# EAGLE design airflow_sensor_hot_wire (EAGLE 9.5.2)
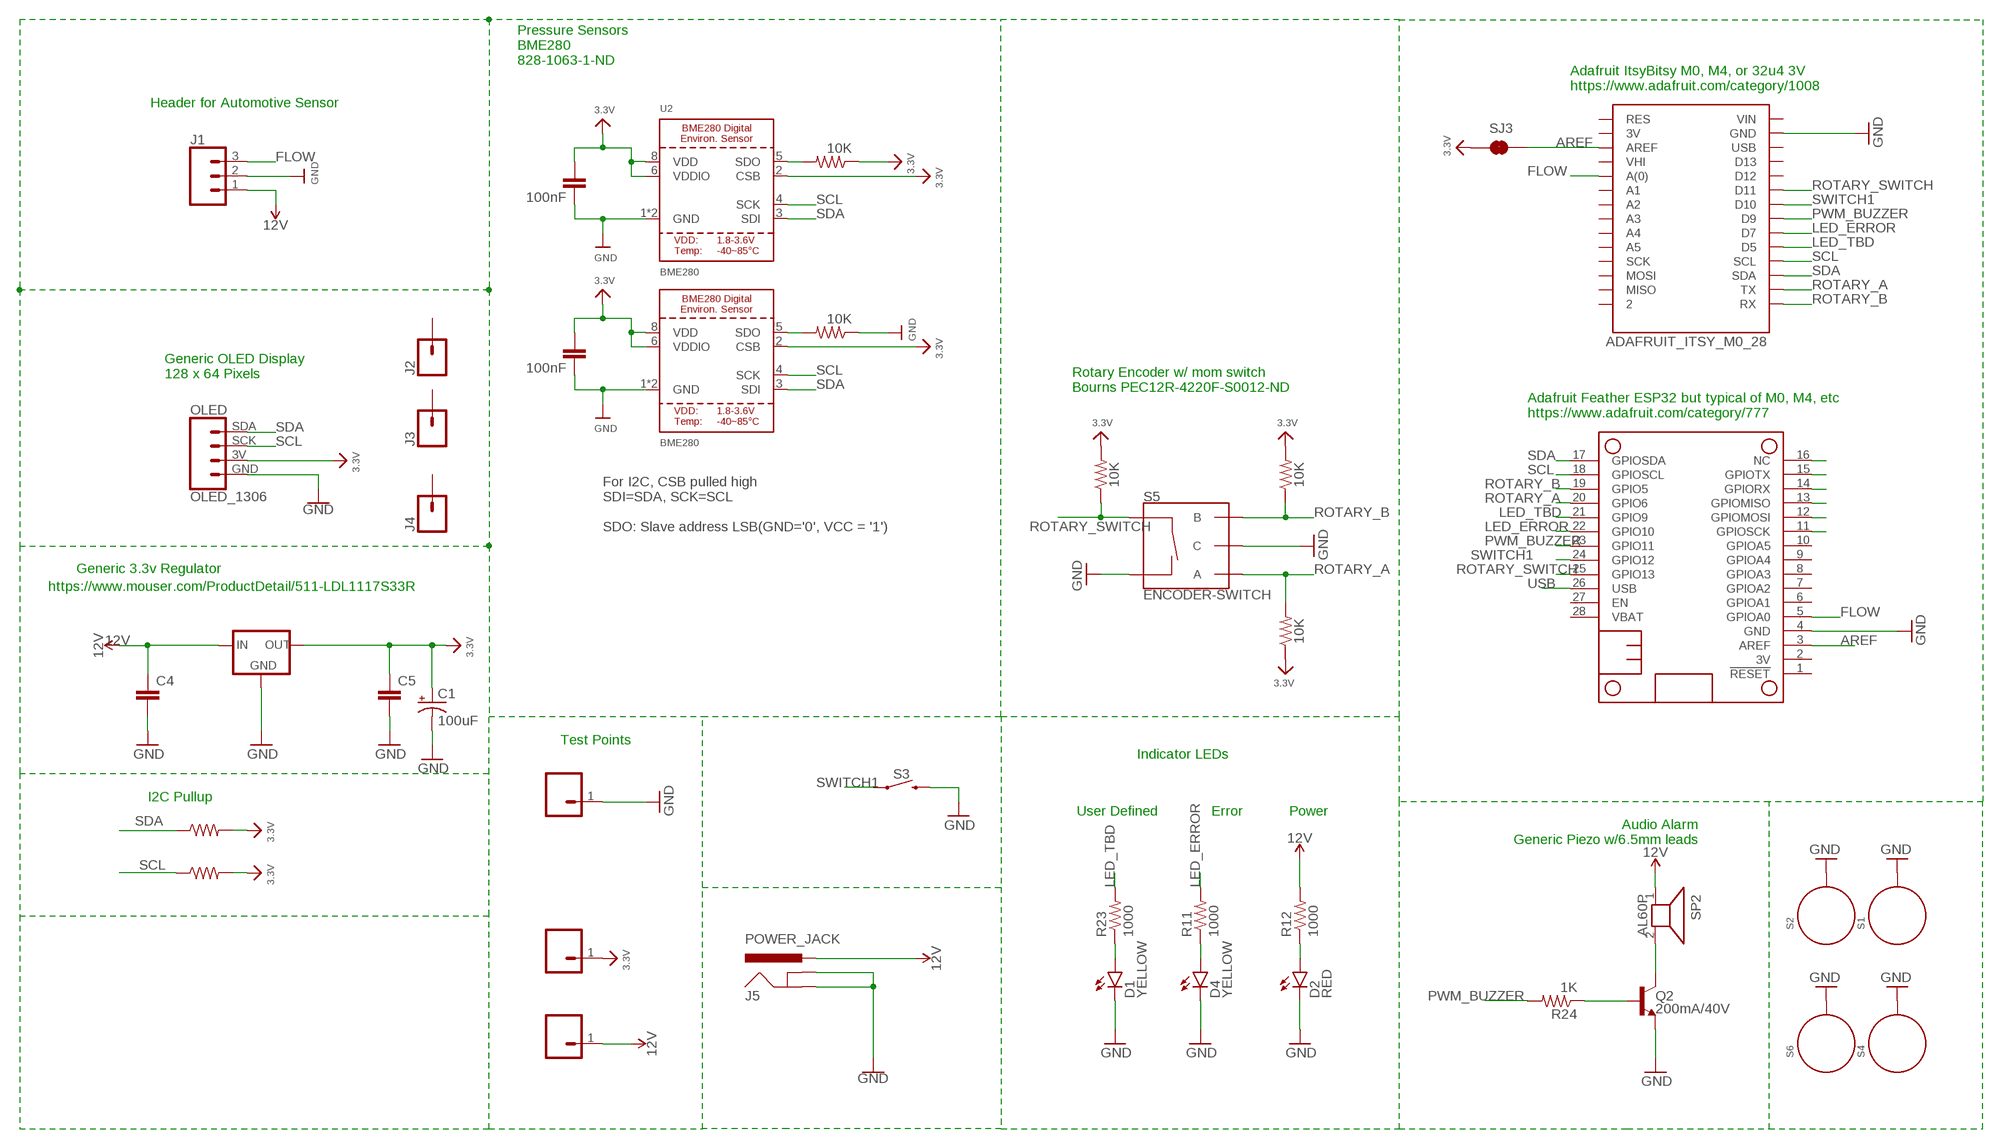
[diagram p0: schematic, sheet 1]

## Parts
3V_REGULATOR  LDL1117_5V_REG  [SOT223]
C1  100uF  100UF-POLAR-RADIAL-2.5MM-25V-20%  [CPOL-RADIAL-2.5MM-6.5MM]
C4  CAP-0805  [0805]
C5  CAP-0805  [0805]
C10  100nF  CAP-0805  [0805]
C12  100nF  CAP-0805  [0805]
D1  YELLOW  LED-YELLOWLARGE  [LED-1206]
D2  RED  LED-RED1206  [LED-1206]
D4  YELLOW  LED-YELLOWLARGE  [LED-1206]
J1  CONN_03-SCREW-5MM  [SCREWTERMINAL-5MM-3]
J2  CONN_01  [1X01]
J3  CONN_01  [1X01]
J4  CONN_01  [1X01]
J5  POWER_JACK  [POWER_JACK_PTH]
MS2  FEATHERWING_NODIM  [FEATHERWING_DIM]
Q2  200mA/40V  TRANS_NPN-2N3904  [TO-92]
R1  10K  RESISTOR0805-RES  [0805]
R2  10K  RESISTOR0805-RES  [0805]
R11  1000  RESISTOR0805-RES  [0805]
R12  1000  RESISTOR0805-RES  [0805]
R21  0.3  0.3OHM-0805-1/8W-1%  [0805]
R22  0.3  0.3OHM-0805-1/8W-1%  [0805]
R23  1000  RESISTOR0805-RES  [0805]
R24  1K  RESISTOR0805-RES  [0805]
R26  10K  0.3OHM-0805-1/8W-1%  [0805]
R27  10K  0.3OHM-0805-1/8W-1%  [0805]
R28  10K  0.3OHM-0805-1/8W-1%  [0805]
S1  STANDOFF_ELECTRICAL5-32  [STANDOFF_ELECTRICAL_5_32]
S2  STANDOFF_ELECTRICAL5-32  [STANDOFF_ELECTRICAL_5_32]
S3  MOMENTARY-SWITCH-SPST-PTH-6.0MM-KIT  [TACTILE_SWITCH_PTH_6.0MM_KIT]
S4  STANDOFF_ELECTRICAL5-32  [STANDOFF_ELECTRICAL_5_32]
S5  ENCODER-SWITCH  [ROTARY_ENC_PLAIN]
S6  STANDOFF_ELECTRICAL5-32  [STANDOFF_ELECTRICAL_5_32]
SJ3  PWR-LED  JUMPER-PAD-2-NC_BY_TRACENO_SILK  [PAD-JUMPER-2-NC_BY_TRACE_NO_SILK]
SP2  AL60P  [AL60P]
U2  BME280  [BME280]
U4  BME280  [BME280]
U$1  OLED_1306  [OLED_1306]
U$20  CONN_0138MILL  [1X01-40MILL]
U$31  CONN_0138MILL  [1X01-40MILL]
U$40  CONN_0138MILL  [1X01-40MILL]
U$45  ADAFRUIT_ITSY_M0_28  [ADAFRUIT_ITS_MO_28]

## Nets
3.3V: 3V_REGULATOR.2(OUT) 3V_REGULATOR.4(OUT) C1.1(+) C5.1 C10.1 C12.1 R2.1 R21.2 R22.2 R26.2 R27.1 R28.2 SJ3.2 U2.2(CSB) U2.6(VDDIO) U2.8(VDD) U4.2(CSB) U4.6(VDDIO) U4.8(VDD) U$1.3V(VCC) U$20.1
12V: 3V_REGULATOR.3(IN) C4.1 J1.1 J5.PWR R12.2 SP2.1 U$40.1
AREF: MS2.3(AREF) SJ3.1 U$45.AREF
FLOW: J1.3 MS2.5(GPIOA0) U$45.A0(A(0))
GND: 3V_REGULATOR.1(GND) C1.2(-) C4.2 C5.2 C10.2 C12.2 D1.C D2.C D4.C J1.2 J5.GND J5.GNDBREAK MS2.4(GND) Q2.1(E) R1.1 S1.P1 S2.P1 S3.3 S4.P1 S5.C S5.SW- S6.P1 U2.1(GND) U2.7(GND) U4.1(GND) U4.7(GND) U$1.GND U$31.1 U$45.GND
LED_ERROR: MS2.22(GPIO10) R11.2 U$45.D7
LED_TBD: MS2.21(GPIO9) R23.2 U$45.D5
N$2: D2.A R12.1
N$3: D1.A R23.1
N$6: R1.2 U4.5(SDO)
N$7: MS2.16(NC)
N$8: R2.2 U2.5(SDO)
N$9: Q2.3(C) SP2.2
N$10: Q2.2(B) R24.1
N$11: D4.A R11.1
N$13: MS2.15(GPIOTX)
N$14: MS2.14(GPIORX)
N$15: MS2.13(GPIOMISO)
N$16: MS2.12(GPIOMOSI)
N$17: MS2.11(GPIOSCK)
PWM_BUZZER: MS2.23(GPIO11) R24.2 U$45.D9
ROTARY_A: MS2.20(GPIO6) R27.2 S5.A U$45.TX
ROTARY_B: MS2.19(GPIO5) R26.1 S5.B U$45.RX
ROTARY_SWITCH: MS2.25(GPIO13) R28.1 S5.SW+ U$45.D11
SCL: MS2.18(GPIOSCL) R22.1 U2.4(SCK) U4.4(SCK) U$1.SCK U$45.SCL
SDA: MS2.17(GPIOSDA) R21.1 U2.3(SDI) U4.3(SDI) U$1.SDA U$45.SDA
SWITCH1: MS2.24(GPIO12) S3.1 U$45.D10
USB: MS2.26(USB)
Unconnected: J2.1 J3.1 J4.1 MS2.1(!RESET) MS2.2(3V) MS2.6(GPIOA1) MS2.7(GPIOA2) MS2.8(GPIOA3) MS2.9(GPIOA4) MS2.10(GPIOA5) MS2.27(EN) MS2.28(VBAT) U$45.2 U$45.3V U$45.A1 U$45.A2 U$45.A3 U$45.A4 U$45.A5 U$45.D12 U$45.D13 U$45.MISO U$45.MOSI U$45.RES U$45.SCK U$45.USB U$45.VHI U$45.VIN

## Notes on the sheet
- Pressure Sensors
  BME280
  828-1063-1-ND
- Adafruit ItsyBitsy M0, M4, or 32u4 3V
  https://www.adafruit.com/category/1008
- Header for Automotive Sensor
- Generic OLED Display
  128 x 64 Pixels
- Rotary Encoder w/ mom switch
  Bourns PEC12R-4220F-S0012-ND
- Adafruit Feather ESP32 but typical of M0, M4, etc
  https://www.adafruit.com/category/777
- For I2C, CSB pulled high
  SDI=SDA, SCK=SCL
  
  SDO: Slave address LSB(GND='0', VCC = '1')
- https://www.mouser.com/ProductDetail/511-LDL1117S33R | Generic 3.3v Regulator
- Test Points
- Indicator LEDs
- I2C Pullup
- User Defined | Error | Power
- Audio Alarm
  Generic Piezo w/6.5mm leads

## Library data of the parts
3V_REGULATOR = th_libraries_2:LDL1117_5V_REG: STMicroelectronics LDL1117S50R https://www.mouser.com/datasheet/2/389/ldl1117-1156241.pdf Mouser#: 511-LDL1117S50R bought 100 for $18 on ~2/3/18 5V, 1.2amp
C1 = SparkFun-Capacitors:100UF-POLAR: 100µF polarized capacitors A capacitor is a passive two-terminal electrical component used to store electrical energy temporarily in an electric field.; PROD_ID: CAP-08439
C4 C5 C10 C12 = SparkFun-Capacitors:CAP
D1 D4 = SparkFun-LED:LED-YELLOW: Yellow SMD LEDs LilyPad 1206- DIO-09909 0603- DIO-09003 "SMART" means more efficient and expensive; PROD_ID: DIO-00820
D2 = SparkFun-LED:LED-RED: Assorted Red LEDs LilyPad 1206- DIO-09912 1206- DIO-00809 0603- DIO-00819 "SMART" means more efficient and expensive; PROD_ID: DIO-00809
J1 = SparkFun-Connectors:CONN_03: Multi connection point. Often used as Generic Header-pin footprint for 0.1 inch spaced/style header connections On any of the 0.1 inch spaced packages, you can populate with these: Break Away Headers - Straight <https://www.sparkfun.com/products/116> (PRT-00116) Break Away Male Headers - Right Angle <https://www.sparkfun.com/products/553> (PRT-00553) Female Headers <https://www.sparkfun.com/products/115> (PRT-00115) Break Away Headers - Machine Pin <https://www.sparkfun.com/products/117> (PRT-00117) Break Away Female Headers - Swiss Machine Pin <https://www.sparkfun.com/products/743> (PRT-00743) Stackable Header - 3 Pin (Female, 0.1") <https://www.sparkfun.com/products/13875> (PRT-13875) For SCREWTERMINALS and SPRING TERMINALS visit here: Screw Terimnals on SparkFun.com <https://www.sparkfun.com/search/results?term=Screw+Terminals> (5mm/3.5mm/2.54mm spacing) This device is also useful as a general connection point to wire up your design to another part of your project. Our various solder wires solder well into these plated through hole pads. Hook-Up Wire - Assortment (Stranded, 22 AWG) <https://www.sparkfun.com/products/11375> (PRT-11375) Hook-Up Wire - Assortment (Solid Core, 22 AWG) <https://www.sparkfun.com/products/11367> (PRT-11367) View the entire wire category on our website here <https://www.sparkfun.com/categories/141> Special notes: Molex polarized connector foot print use with SKU : PRT-08232 with associated crimp pins and housings.; PROD_ID: CONN-10134; SF_SKU: PRT-08433
J2-J4 = SparkFun-Connectors:CONN_01: Single connection point. Often used as Generic Header-pin footprint for 0.1 inch spaced/style header connections On any of the 0.1 inch spaced packages, you can populate with these: Break Away Headers - Straight <https://www.sparkfun.com/products/116> (PRT-00116) Break Away Male Headers - Right Angle <https://www.sparkfun.com/products/553> (PRT-00553) Female Headers <https://www.sparkfun.com/products/115> (PRT-00115) Break Away Headers - Machine Pin <https://www.sparkfun.com/products/117> (PRT-00117) Break Away Female Headers - Swiss Machine Pin <https://www.sparkfun.com/products/743> (PRT-00743) This device is also useful as a general connection point to wire up your design to another part of your project. Our various solder wires solder well into these plated through hole pads. Hook-Up Wire - Assortment (Stranded, 22 AWG) <https://www.sparkfun.com/products/11375> (PRT-11375) Hook-Up Wire - Assortment (Solid Core, 22 AWG) <https://www.sparkfun.com/products/11367> (PRT-11367) View the entire wire category on our website here <https://www.sparkfun.com/categories/141> Special notes: SMTSO-256-ET is a "flush mount" nut for a 4-40 screw. We mostly use this on specialty testbeds; it is a nice way to connect hardware to your PCB at an adjustable hieght. Also note, the SNAP packages are for using a snappable style connector. We sell a baggie of snaps and they are also used on two LilyPad designs: Snap Assortment - 30 pack (male and female) <https://www.sparkfun.com/products/11347> (DEV-11347) LilyPad Arduino SimpleSnap <https://www.sparkfun.com/products/10941> (DEV-10941) LilyPad SimpleSnap Protoboard <https://www.sparkfun.com/products/10940> (DEV-10940)
J5 = SparkFun-Connectors:POWER_JACK: Power Jack Connector This is the standard 5.5mm barrel jack for power. The PTH is the most common, proven, reliable, footprint. The Slot footprint only works if the mill layer is transmitted to the PCB fab house so be warned. Here are the connectors we sell at SparkFun: DC Barrel Power Jack/Connector <https://www.sparkfun.com/products/119> (PRT-00119) DC Barrel Power Jack/Connector (SMD) <https://www.sparkfun.com/products/12748> (PRT-12748) DC Barrel Jack Adapter - Breadboard Compatible <https://www.sparkfun.com/products/10811> (PRT-10811) It is used on this SparkFun product (and many, many others): SparkFun RedBoard - Programmed with Arduino <https://www.sparkfun.com/products/12757> (DEV-12757) Also, if you need a mating power supply or connector, please check these out: Wall Adapter Power Supply - 9VDC 650mA <https://www.sparkfun.com/products/298> (TOL-00298) DC Barrel Jack Adapter - Male <https://www.sparkfun.com/products/10287> (PRT-10287); PROD_ID: CONN-08197
MS2 = th_libraries:FEATHERWING
Q2 = SparkFun-DiscreteSemi:TRANS_NPN: NPN transistor Current controlled devices typically used to amplify current or used as a switch. BC547 - COM-08928 <http://www.sparkfun.com/products/8928> (TO-92 45V 100mA) (1.Collector 2.Base 3.Emitter) 2N3904 - COM-00521 <http://www.sparkfun.com/products/521> (TO-92 40V 200mA) (1.Emitter 2.Base 3.Collector) P2N2222A - COM-12852 <http://www.sparkfun.com/products/12852> (TO-92 40V 600mA) (1.Collector 2.Base 3.Emitter); PROD_ID: TRANS-08447
R1 R2 R11 R12 R23 R24 = SparkFun-Passives:RESISTOR: Resistor Basic schematic elements and footprints for 0603, 1206, and PTH resistors.
R21 R22 = SparkFun-Resistors:0.3OHM: 0.3Ω resistor A resistor is a passive two-terminal electrical component that implements electrical resistance as a circuit element. Resistors act to reduce current flow, and, at the same time, act to lower voltage levels within circuits. - Wikipedia; PROD_ID: RES-11622
R26-R28 = SparkFun-Resistors:0.3OHM: 0.3Ω resistor A resistor is a passive two-terminal electrical component that implements electrical resistance as a circuit element. Resistors act to reduce current flow, and, at the same time, act to lower voltage levels within circuits. - Wikipedia; PROD_ID: RES-11622; VALUE: 0.3
S1 S2 S4 S6 = th_libraries:STANDOFF_ELECTRICAL: A standoff intended to be an electrically connected point. Pad size and stop size allow for a #8 Phillips pan screw head to make a solid connection to the board. Added 144mill drill hole that fits my normal wood screw
S3 = SparkFun-Switches:MOMENTARY-SWITCH-SPST: Momentary Switch (Pushbutton) - SPST Normally-open (NO) SPST momentary switches (buttons, pushbuttons). Variants PTH-12MM - 12mm square, through-hole Momentary Pushbutton Switch - 12mm Square <https://www.sparkfun.com/products/9190> (COM-09190) PTH-6.0MM, PTH-6.0MM-KIT - 6.0mm square, through-hole Mini Pushbutton Switch <https://www.sparkfun.com/products/97> (COM-00097) KIT package intended for soldering kit's - only one side of pads' copper is exposed. PTH-RIGHT-ANGLE-KIT - Right-angle, through-hole Right Angle Tactile Button <https://www.sparkfun.com/products/10791> - Used on SparkFun BigTime Watch Kit <https://www.sparkfun.com/products/11734> SMD-12MM - 12mm square, surface-mount Tactile Button - SMD (12mm) <https://www.sparkfun.com/products/12993> (COM-12993) Used on SparkFun PicoBoard <https://www.sparkfun.com/products/11888> SMD-4.5MM - 4.5mm Square Trackball Switch Used on SparkFun Blackberry Trackballer Breakout <https://www.sparkfun.com/products/13169> SMD-4.6MMX2.8MM - 4.60mm x 2.80mm, surface mount Used on SparkFun SAMD21 Mini Breakout <https://www.sparkfun.com/products/13664> SMD-5.2MM, SMD-5.2-REDUNDANT - 5.2mm square, surface-mount Mini Pushbutton Switch - SMD <https://www.sparkfun.com/products/8720> (COM-08720) Used on Arduino Pro Mini <https://www.sparkfun.com/products/11114> REDUNDANT package connects both switch circuits together SMD-6.0X3.5MM - 6.0 x 3.5mm, surface mount Momentary Reset Switch SMD <https://www.sparkfun.com/products/8229> (COM-08229) SMD-6.2MM-TALL - 6.2mm square, surface mount Tactile Button - SMD (6mm) <https://www.sparkfun.com/products/12992> Used on SparkFun Digital Sandbox <https://www.sparkfun.com/products/12651> SMD-RIGHT-ANGLE - Right-angle, surface mount Used on SparkFun Block for Intel® Edison - Arduino <https://www.sparkfun.com/products/13036>; PROD_ID: SWCH-08441; SF_SKU: COM-00097
S5 = SparkFun-Switches:ENCODER-SWITCH: Rotary Encoder w/ Select Switch Encoders rotate similarly to potentiometers, but they’re different from potentiometers in that an encoder has full rotation without limits. They output gray code so that you can tell how much and in which direction the encoder has been turned. This encoder includes a push-down select switch built into the shaft. SparkFun Products Rotary Encoder <https://www.sparkfun.com/products/9117> (COM-09117); SF_SKU: COM-09117
SJ3 = SparkFun-Passives:JUMPER-PAD-2-NC_BY_TRACE
SP2 = buzzer:AL60P: SPEAKER Source: Buerklin; OC_FARNELL: unknown; OC_NEWARK: unknown
U2 U4 = microbuilder:BME280: BME280 - Environmental Sensor (I2C + SPI)
U$1 = air_flow:OLED_1306
U$20 U$31 U$40 = th_libraries3:CONN_01
U$45 = easy_bee_counter:ADAFRUIT_ITSY_M0_28

## Net classes
1 highpower: width 0.305 mm, drill 0.483 mm
2 lowpower: width 0.305 mm, drill 0.483 mm

## Board
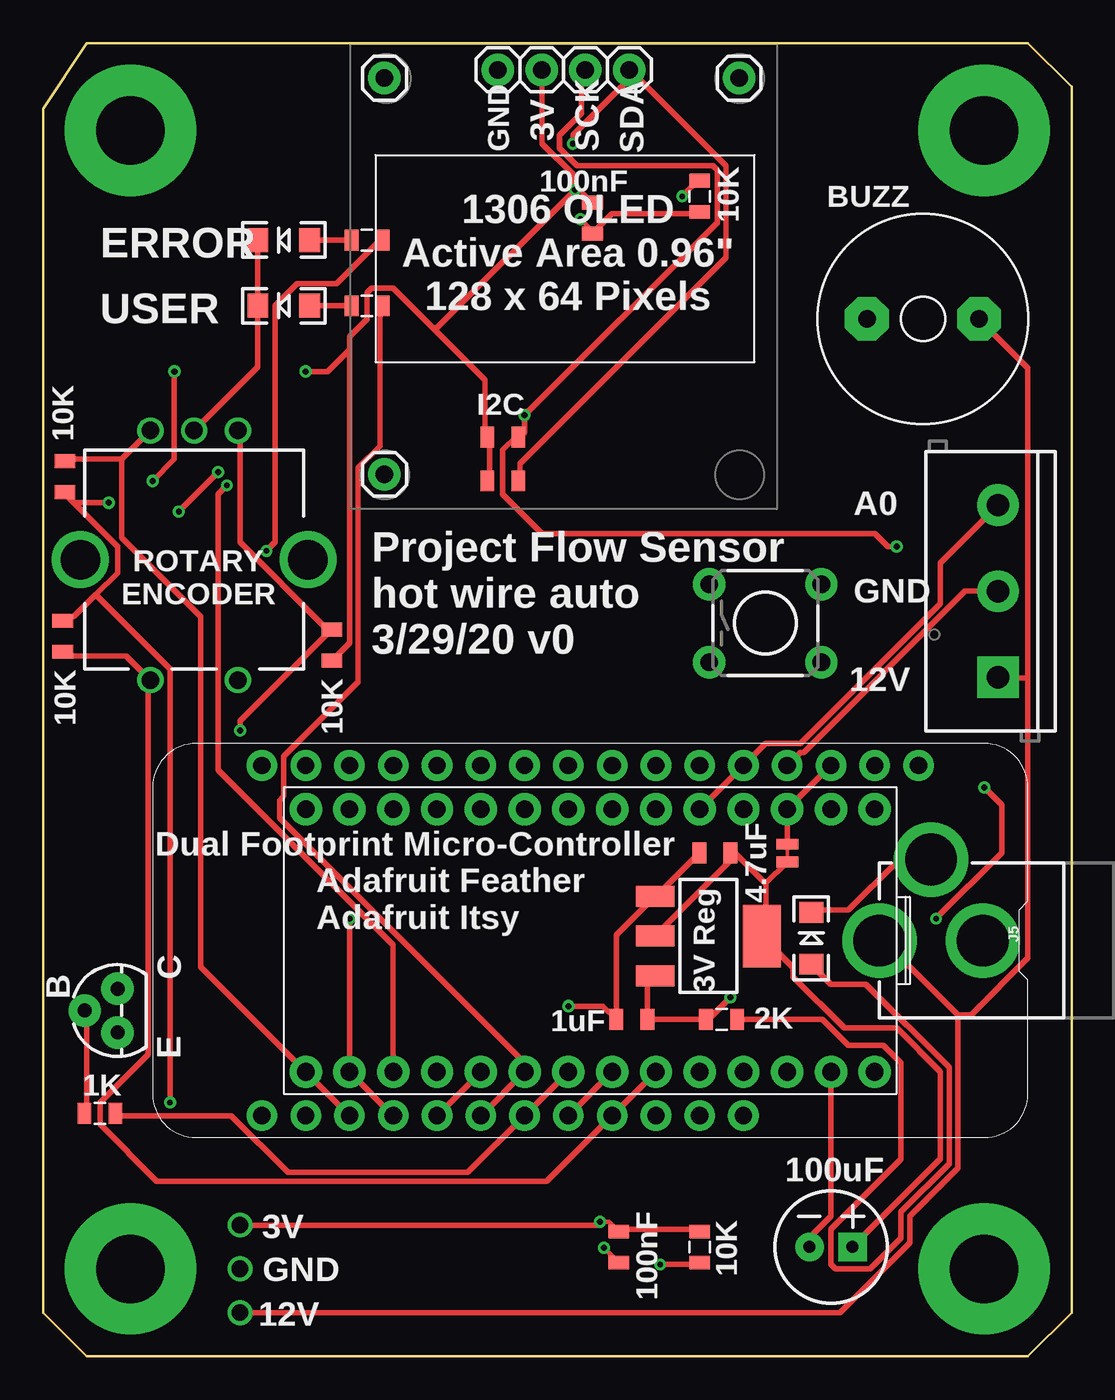
[diagram p1: board, top side]
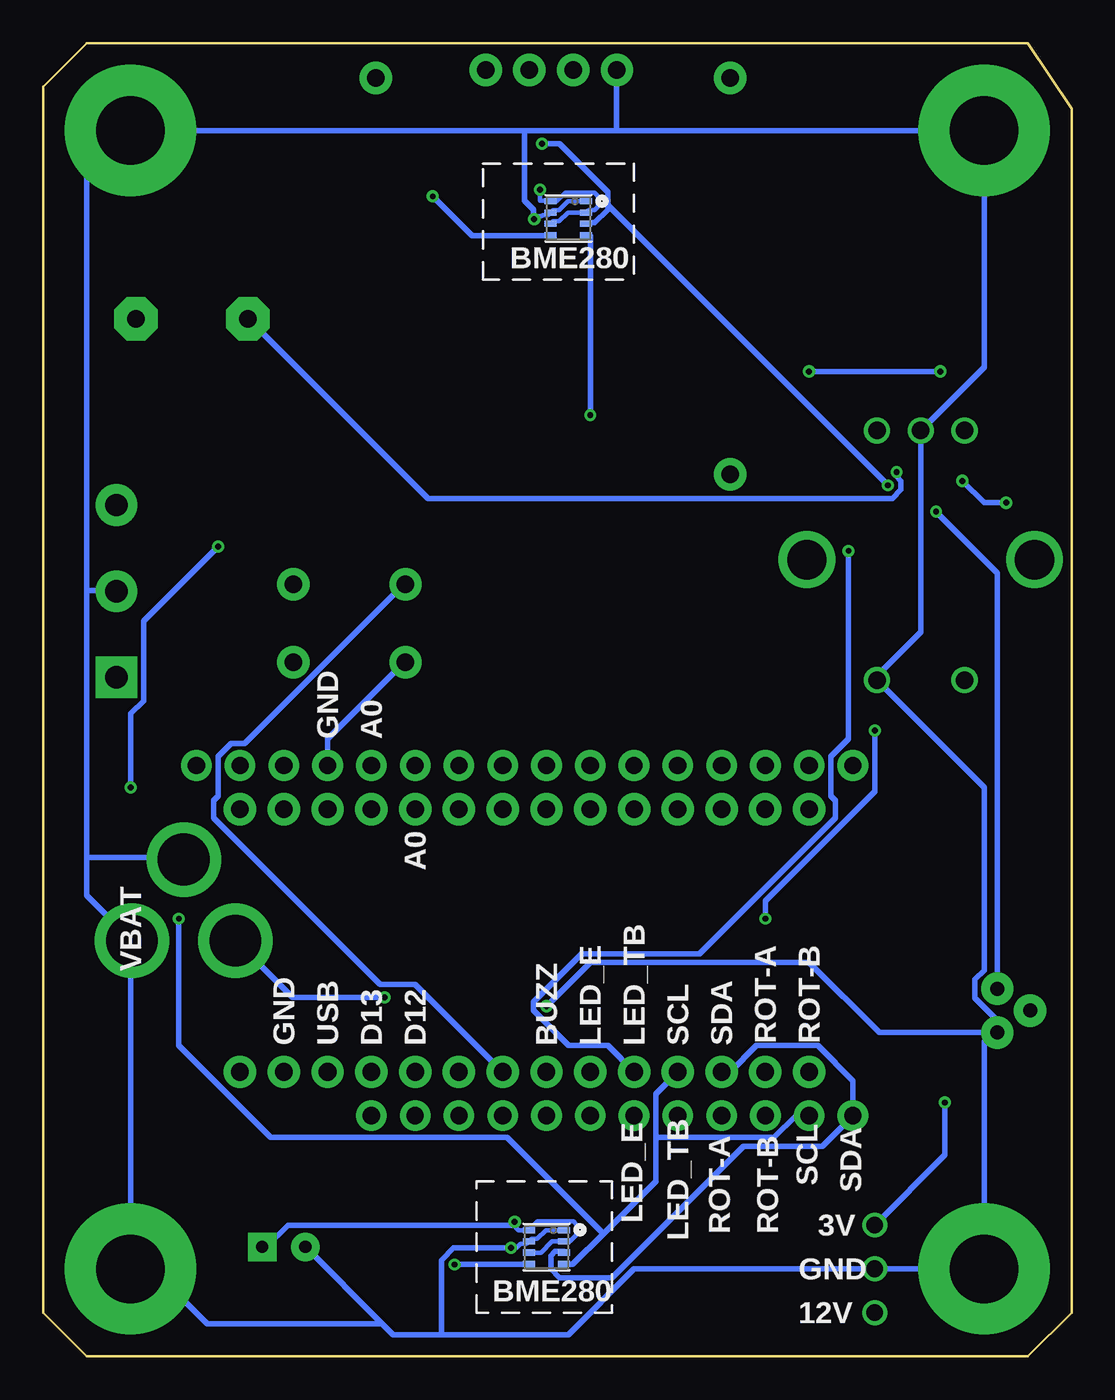
[diagram p2: board, bottom side, seen from below]

Size 59.69 x 76.2 mm. Coordinates in mm from the lower left corner, seen from the top.
Outline: 0,72.39 0,2.54 2.54,0 57.15,0 59.69,2.54 59.69,73.66 57.15,76.2 2.54,76.2 0,72.39
Copper layers (1*16): Top 0.0356mm / dielectric 1.5011mm / Bottom 0.0356mm
Design rules "LaenPCBOrder *": minimum track width 8mil, minimum drill 13mil, track to track 8mil, track to pad 8mil, pad to pad 8mil, via to via 8mil, smd to smd 6mil, copper to edge 15mil, drill to drill 6mil, minimum pad ring 7mil, minimum via ring 7mil, stop-mask expansion 3mil, vias tented up to drill 25mil, thermal gap 10mil

### Footprints (pad centres in the part's own frame; a part is rotated, then mirrored left to right if it is on the bottom)
SOT223 = smd 1.219 x 2.235: 1 -2.311,-3.099; 2 0,-3.099; 3 2.311,-3.099 | smd 3.6 x 2.2: 4 0,3.099
CPOL-RADIAL-2.5MM-6.5MM = drill 0.7 pad 1.651 square: 1 1.25,0 | drill 0.7 pad 1.651: 2 -1.25,0
0805 = smd 0.8 x 1.2: 1 -0.9,0; 2 0.9,0
LED-1206 = smd 1.2 x 1.4: A -1.5,0; C 1.5,0
SCREWTERMINAL-5MM-3 = drill 1.3 pad 2.413 square: 1 0,0 | drill 1.3 pad 2.413: 2 5,0; 3 10,0
1X01 = drill 1.016 pad 1.88: 1 0,0
POWER_JACK_PTH = drill 2.997 pad 4.318: GND 0,7.7; GNDBREAK 4.7,10.7; PWR 0,13.7
FEATHERWING_DIM = drill 1 pad 1.778: 1 6.35,1.27; 2 8.89,1.27; 3 11.43,1.27; 4 13.97,1.27; 5 16.51,1.27; 6 19.05,1.27; 7 21.59,1.27; 8 24.13,1.27; 9 26.67,1.27; 10 29.21,1.27; 11 31.75,1.27; 12 34.29,1.27; 13 36.83,1.27; 14 39.37,1.27; 15 41.91,1.27; 16 44.45,1.27; 17 44.45,21.59; 18 41.91,21.59; 19 39.37,21.59; 20 36.83,21.59; 21 34.29,21.59; 22 31.75,21.59; 23 29.21,21.59; 24 26.67,21.59; 25 24.13,21.59; 26 21.59,21.59; 27 19.05,21.59; 28 16.51,21.59
TO-92 = drill 0.813 pad 1.88: 1 -1.27,0; 2 0,1.905; 3 1.27,0
STANDOFF_ELECTRICAL_5_32 = drill 3.969 pad 7.62: P1 0,0
TACTILE_SWITCH_PTH_6.0MM_KIT = drill 1.016 pad 1.88: 1 -3.251,2.261; 2 3.251,2.261; 3 -3.251,-2.261; 4 3.251,-2.261
ROTARY_ENC_PLAIN = drill 1.016: A 7.493,-2.54; B 7.493,2.54; C 7.493,0; SW+ -6.985,2.54; SW- -6.985,-2.54 | drill 2.286: P$3 0,6.604; P$4 0,-6.604
PAD-JUMPER-2-NC_BY_TRACE_NO_SILK = smd 0.635 x 1.27: 1 -0.508,0; 2 0.508,0
AL60P = drill 1.016 pad 2.54 octagon: 1 -3.251,0; 2 3.251,0
BME280 = smd 0.7 x 0.35: 1 1.025,0.975; 2 1.025,0.325; 3 1.025,-0.325; 4 1.025,-0.975; 5 -1.025,-0.975; 6 -1.025,-0.325; 7 -1.025,0.325; 8 -1.025,0.975
OLED_1306 = drill 1.016 pad 1.88: 3V 11.15,-1.55; GND 8.61,-1.55; SCK 13.69,-1.55; SDA 16.23,-1.55
1X01-40MILL = drill 0.965 pad 1.397: 1 0,0
ADAFRUIT_ITS_MO_28 = drill 1.016 pad 1.88: 2 -7.62,-8.89; 3V -7.62,21.59; A0 -7.62,13.97; A1 -7.62,11.43; A2 -7.62,8.89; A3 -7.62,6.35; A4 -7.62,3.81; A5 -7.62,1.27; AREF -7.62,19.05; D5 7.62,1.27; D7 7.62,3.81; D9 7.62,6.35; D10 7.62,8.89; D11 7.62,11.43; D12 7.62,13.97; D13 7.62,16.51; GND 7.62,21.59; MISO -7.62,-6.35; MOSI -7.62,-3.81; RES -7.62,24.13; RX 7.62,-8.89; SCK -7.62,-1.27; SCL 7.62,-1.27; SDA 7.62,-3.81; TX 7.62,-6.35; USB 7.62,19.05; VHI -7.62,16.51; VIN 7.62,24.13

### Placement (x,y rotation side)
3V_REGULATOR  38.61,24.38 270 top
C1  45.72,6.35 0 top
C4  34.16,19.56 180 top
C5  38.99,29.21 180 top
C10  33.4,6.35 270 top
C12  31.88,66.04 270 top
D1  13.97,64.77 180 top
D2  44.58,24.26 90 top
D4  13.97,60.96 180 top
J1  55.42,39.4 90 top
J2  19.81,51.18 0 top
J3  40.39,74.17 0 top
J4  19.81,74.17 0 top
J5  62.23,24.13 90 top
MS2  57.15,35.56 180 top
Q2  4.32,20.07 90 top
R1  38.1,67.31 90 top
R2  38.1,6.35 270 top
R11  18.8,60.96 0 top
R12  39.37,19.56 180 top
R21  26.67,50.8 180 top
R22  26.67,53.34 180 top
R23  18.8,64.77 0 top
R24  3.3,14.1 0 top
R26  1.27,51.05 270 top
R27  16.76,41.27 90 top
R28  1.14,41.78 90 top
S1  5.08,71.12 0 top
S2  5.08,5.08 0 top
S3  41.91,42.55 0 top
S4  54.61,71.12 0 top
S5  8.76,46.23 90 top
S6  54.61,5.08 0 top
SJ3  43.18,29.21 270 top
SP2  51.05,60.2 180 top
U2  30.48,6.35 0 bottom
U4  29.21,66.04 0 bottom
U$1  17.78,76.2 0 top
U$20  11.43,7.62 270 top
U$31  11.43,5.08 270 top
U$40  11.43,2.54 270 top
U$45  24.13,24.13 270 top

### Tracks (layer width: path | path; a pad name or v marks a point on that pad's centre or on a via)
3.3V  (via drill 0.33, 0.35)
  Top 0.254: v32.32,7.81 32.84,7.81 C10.1 | v30.86,67.69 31.13,67.69 C12.1
  Top 0.305: 3V_REGULATOR.4 41.94,24.16 | 41.94,24.16 43.52,22.57 43.52,22.01 46.48,19.05 49.53,19.05 52.07,16.51 52.07,11.45 C1.1 | SJ3.2 41.94,27.46 41.94,27.43 | 41.94,27.43 41.94,24.16 | 3V_REGULATOR.2 39.89,28.76 C5.1 40.13,29.21 41.91,27.43 41.94,27.43 | 30.73,67.69 30.73,68.58 28.96,70.36 28.96,74.42 U$1.3V | 30.73,67.69 30.73,67.56 22.86,59.69 22.61,59.69 | 17.78,58.42 17.78,59.18 18.8,60.2 18.8,61.72 19.05,61.98 20.32,61.98 22.61,59.69 | 17.78,58.42 17.78,41.4 R27.1 | 22.61,59.69 25.65,56.64 25.65,53.34 R22.2 25.91,53.34 25.91,50.8 R21.2 | 30.73,67.69 v30.86,67.69 | 3.05,44.2 4.32,45.47 4.32,46.99 1.78,49.53 | 3.05,44.2 1.78,42.93 1.27,42.93 R28.2 | R26.2 1.27,50.04 1.78,49.53 | R2.1 38.1,7.37 33.53,7.37 C10.1 | U$20.1 32.26,7.62 v32.32,7.81 | 3.05,44.2 7.37,39.88 v7.37,14.73 | 17.78,58.42 16.51,57.15 v15.24,57.15 | v7.62,57.15 7.62,52.07 v6.35,50.8 | v3.81,49.53 1.78,49.53
  Bottom 0.254: v32.32,7.81 32.45,7.68 32.09,7.33 U2.8 31,7.83 28.91,7.83 28.7,7.62 28.7,7.11 28.77,7.04 28.77,7.01 29.11,6.67 U2.2 30.16,6.67 30.8,6.03 U2.6 | v30.86,67.69 30.86,67.06 30.28,67.06 U4.8 29.89,67.02 29.38,67.52 27.7,67.52 27.5,67.33 27.5,66.7 27.7,66.51 28.04,66.51 U4.2 29.24,66.36 29.75,65.86 30.09,65.86 U4.6
  Bottom 0.305: v32.32,7.81 32.51,7.62 45.47,7.62 46.74,6.35 C1.1 | v7.37,14.73 7.37,11.68 U$20.1 | v6.35,50.8 5.08,49.53 v3.81,49.53 | v15.24,57.15 v7.62,57.15
12V  (via drill 0.33)
  Top 0.305: 3V_REGULATOR.3 35.06,21.63 C4.1 R12.2 38.61,19.56 v39.88,20.83 | 54.1,60.2 SP2.1 57.15,57.35 57.15,39.37 | U$40.1 46.23,2.54 50.29,6.6 50.29,8.13 53.09,10.92 53.09,19.81 | 53.09,19.81 48.77,24.13 J5.PWR | 57.15,39.37 57.15,23.11 53.85,19.81 53.09,19.81 | 57.15,39.37 55.45,39.37 J1.1
  Bottom 0.305: v39.88,20.83 45.21,20.83 48.51,24.13 J5.PWR
AREF
  Top 0.305: SJ3.1 U$45.AREF MS2.3
FLOW
  Top 0.305: U$45.A0 MS2.5 41.91,35.56 43.94,35.56 52.07,43.69 52.07,46.04 J1.3
GND  (via drill 0.35)
  Top 0.254: v32.54,6.3 32.55,6.3 C10.2 | v31.19,65.98 31.88,65.3 C12.2
  Top 0.305: C5.2 35.57,26.7 3V_REGULATOR.1 33.26,24.45 C4.2 32.5,20.32 v30.48,20.32 | D2.C 44.7,25.91 46.74,25.91 49.53,28.7 51.31,28.7 J5.GNDBREAK | R1.1 38.1,66.29 33.02,66.29 32,65.28 C12.2 | 12.45,60.96 12.45,64.77 D1.C | 12.45,60.96 12.45,57.4 S5.C | 12.45,60.96 D4.C | U$45.GND 45.72,8.13 44.7,7.11 44.7,6.35 C1.2 | MS2.4 43.94,35.05 44.15,35.05 53.5,44.39 J1.2
  Bottom 0.254: v32.54,6.3 32.51,6.27 32.25,6.27 31.99,6.53 31.65,6.53 U2.7 31.36,6.82 31.02,6.82 30.51,7.33 U2.1 | v31.19,65.98 31.01,66.16 31.01,66.17 30.77,66.17 30.72,66.22 30.38,66.22 U4.7 30.09,66.51 29.75,66.51 29.24,67.02 U4.1
  Bottom 0.305: 40.02,1.9 39.39,1.27 36.58,1.27 | 40.02,1.9 C1.2 | 36.58,1.27 29.21,1.27 25.4,5.08 U$31.1 S2.P1 5.08,18.29 4.32,19.05 | 40.02,1.9 50.16,1.9 53.34,5.08 S6.P1 54.61,24.13 J5.GND 57.15,26.75 57.15,28.96 | 57.15,28.96 57.15,44.45 | 57.15,44.45 57.15,68.58 S4.P1 31.75,71.12 | 31.75,71.12 26.42,71.12 | 26.42,71.12 S1.P1 5.08,57.4 S5.C 8.76,42.04 11.43,39.37 S5.SW- 5.08,33.02 5.08,22.41 5.61,21.87 5.61,20.8 4.32,19.5 4.32,19.05 | 4.32,19.05 Q2.1 11.18,18.8 15.24,22.86 27.94,22.86 v30.48,20.32 | MS2.4 43.18,35.81 38.86,40.13 S3.3 | v32.54,6.3 35.87,6.3 36.58,5.59 36.58,1.27 | 31.75,71.12 31.75,67.06 31.24,66.55 31.24,66.01 v31.19,65.98 | 26.42,71.12 26.42,74.42 U$1.GND | 57.15,28.96 51.56,28.96 J5.GNDBREAK | J1.2 55.48,44.45 57.15,44.45
LED_ERROR
  Top 0.305: R11.2 19.56,60.96 19.56,52.83 18.29,51.56 18.29,39.12 13.97,34.8 13.97,32.51 13.72,32.26 13.72,31.24 27.94,17.02 U$45.D7 MS2.22
LED_TBD  (via drill 0.33)
  Top 0.305: v12.95,46.74 13.46,47.24 13.46,60.96 14.73,62.23 17.02,62.23 19.56,64.77 R23.2 | U$45.D5 MS2.21
  Bottom 0.305: v12.95,46.74 12.95,35.81 13.97,34.8 13.97,32.51 13.72,32.26 13.72,31.24 21.59,23.37 28.45,23.37 31.24,20.57 31.24,20.07 29.21,18.03 26.92,18.03 U$45.D5
N$2
  Top 0.305: R12.1 45.21,19.56 46.74,18.03 48.77,18.03 49.78,17.02 49.78,11.43 45.72,7.37 45.72,5.33 45.97,5.08 48.01,5.08 49.78,6.86 49.78,8.38 52.58,11.18 52.58,16.76 47.75,21.59 45.72,21.59 44.7,22.61 D2.A
N$3
  Top 0.305: D1.A R23.1
N$6  (via drill 0.33)
  Top 0.305: v37.08,67.31 38.1,68.33 R1.2
  Bottom 0.305: v37.08,67.31 34.8,65.02 30.48,65.02 U4.5
N$8  (via drill 0.33)
  Top 0.305: v35.81,5.33 38.1,5.33 R2.2
  Bottom 0.305: v35.81,5.33 31.75,5.33 U2.5
N$9  (via drill 0.33)
  Top 0.305: v10.16,51.31 v7.87,49.02
  Bottom 0.305: Q2.3 4.32,45.47 v7.87,49.02 | v10.16,51.31 10.16,51.05 9.91,50.8 9.91,50.29 10.41,49.78 37.34,49.78 47.75,60.2 SP2.2
N$10
  Top 0.305: R24.1 2.54,14.22 2.54,20.07 Q2.2
N$11
  Top 0.305: D4.A R11.1
PWM_BUZZER
  Top 0.305: R24.2 4.32,13.97 10.92,13.97 14.22,10.67 24.64,10.67 MS2.23 U$45.D9
ROTARY_A  (via drill 0.33)
  Top 0.305: MS2.20 U$45.TX v17.78,25.4 | 16.26,42.42 16.76,42.42 R27.2 16.26,42.42 | 16.26,42.42 11.43,47.24 11.43,53.59 S5.A | 16.26,42.42 16.62,42.05 11.43,36.85 v11.43,36.32
  Bottom 0.305: v17.78,25.4 17.78,26.42 11.43,32.77 v11.43,36.32
ROTARY_B
  Top 0.305: 4.57,52.07 1.27,52.07 R26.1 | S5.B 4.57,52.07 | MS2.19 U$45.RX 9.14,22.61 9.14,42.93 4.57,47.5 4.57,52.07
ROTARY_SWITCH
  Top 0.305: R28.1 1.27,40.64 4.83,40.64 S5.SW+ 6.1,39.12 6.1,17.53 3.3,14.73 3.3,13.46 6.6,10.16 29.21,10.16 MS2.25 U$45.D11
SCL  (via drill 0.33, 0.35)
  Top 0.305: U$1.SCK 31.24,74.42 31.24,72.14 29.97,70.87 29.97,70.1 30.99,69.09 38.86,69.09 39.12,68.83 39.12,65.79 v27.94,54.61 27.94,53.59 27.69,53.34 R22.1 27.43,53.34 26.67,52.58 26.67,50.04 28.96,47.75 48.26,47.75 49.02,46.99 v49.53,46.99 | v51.82,25.4 55.63,29.21 55.63,32 v54.61,33.02
  Bottom 0.305: 27.18,7.11 24.13,10.16 24.13,12.7 | 27.18,7.11 28.96,5.33 29.21,5.33 U2.4 | 24.13,12.7 24.13,15.24 U$45.SCL | MS2.18 16,13.97 17.27,12.7 24.13,12.7 | v27.94,54.61 27.94,65.02 U4.4 | 27.18,7.11 32.77,12.7 46.48,12.7 51.82,18.03 v51.82,25.4 | v54.61,33.02 54.61,37.29 53.86,38.04 53.86,42.66 v49.53,46.99
SDA  (via drill 0.33)
  Top 0.305: v30.73,70.36 30.73,70.87 33.78,73.91 33.78,74.42 U$1.SDA 34.04,74.68 39.62,69.09 39.62,63.75 27.69,51.82 27.69,50.8 R21.1 | U$45.SDA 20.32,23.88 10.16,34.04 10.16,50.04 v10.67,50.55
  Bottom 0.305: U2.3 29.46,6.1 29.97,6.1 30.23,5.84 30.23,5.08 29.72,4.57 26.67,4.57 19.05,12.19 14.48,12.19 MS2.17 12.7,16 14.73,18.03 18.29,18.03 19.81,16.51 U$45.SDA | 26.92,66.8 26.92,67.56 29.72,70.36 v30.73,70.36 | 26.92,66.8 26.92,66.55 27.69,65.79 27.94,65.79 U4.3 | 26.92,66.8 v10.67,50.55
SWITCH1
  Top 0.305: U$45.D10 MS2.24
  Bottom 0.305: U$45.D10 38.1,21.59 40.13,21.59 49.78,31.24 49.78,32.26 49.53,32.51 49.53,34.8 48.77,35.56 48.01,35.56 38.86,44.7 S3.1

### Text on the board
tPlace: BUZZ | ERROR | USER | I2C | A0 | ROTARY / ENCODER | GND | Project Flow Sensor / hot wire auto / 3/29/20 v0 | 12V | Dual Footprint Micro-Controller / Adafruit Feather / Adafruit Itsy | 3V Reg | 4.7uF | C | B | 1uF | 2K | E | 100uF | 3V | GND | 12V
bPlace: A0 | GND | A0 | VBAT | ROT-B | ROT-A | SDA | SCL | LED_TB | LED_E | BUZZ | D12 | D13 | USB | GND | SCL | SDA | LED_E | 3V | ROT-B | ROT-A | LED_TB | GND | 12V